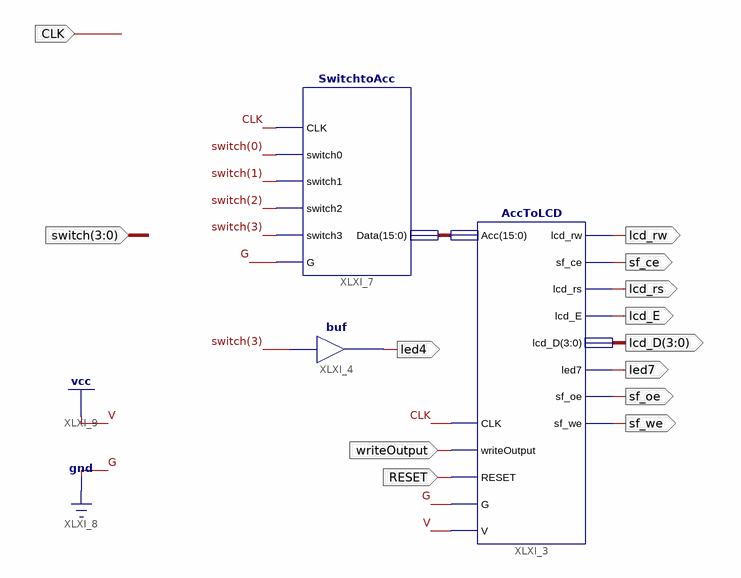
[diagram p0: schematic sheet 1]
// Xilinx ISE schematic Test.sch (spartan3e) as structural Verilog: 3 symbols, 13 ports
module Test (
  input  CLK,
  input  writeOutput,
  input  RESET,
  input  [3:0] switch,
  output lcd_rw,
  output sf_ce,
  output lcd_rs,
  output lcd_E,
  output [3:0] lcd_D,
  output led7,
  output sf_oe,
  output sf_we,
  output led4
);

  wire [15:0] XLXN_1;

  AccToLCD XLXI_3 (
    .Acc(XLXN_1), .CLK(CLK), .writeOutput(writeOutput), .RESET(RESET), .lcd_rw(lcd_rw), .sf_ce(sf_ce),
    .lcd_rs(lcd_rs), .lcd_E(lcd_E), .lcd_D(lcd_D), .led7(led7), .sf_oe(sf_oe), .sf_we(sf_we), .G(1'b0),
    .V(1'b1));
  buf XLXI_4 (led4, switch[3]);
  SwitchtoAcc XLXI_7 (
    .CLK(CLK), .switch0(switch[0]), .switch1(switch[1]), .switch2(switch[2]), .switch3(switch[3]), .G(1'b0),
    .Data(XLXN_1));
endmodule
